# EAGLE schematic line follower INCOMPLETE (EAGLE 9.6.2)
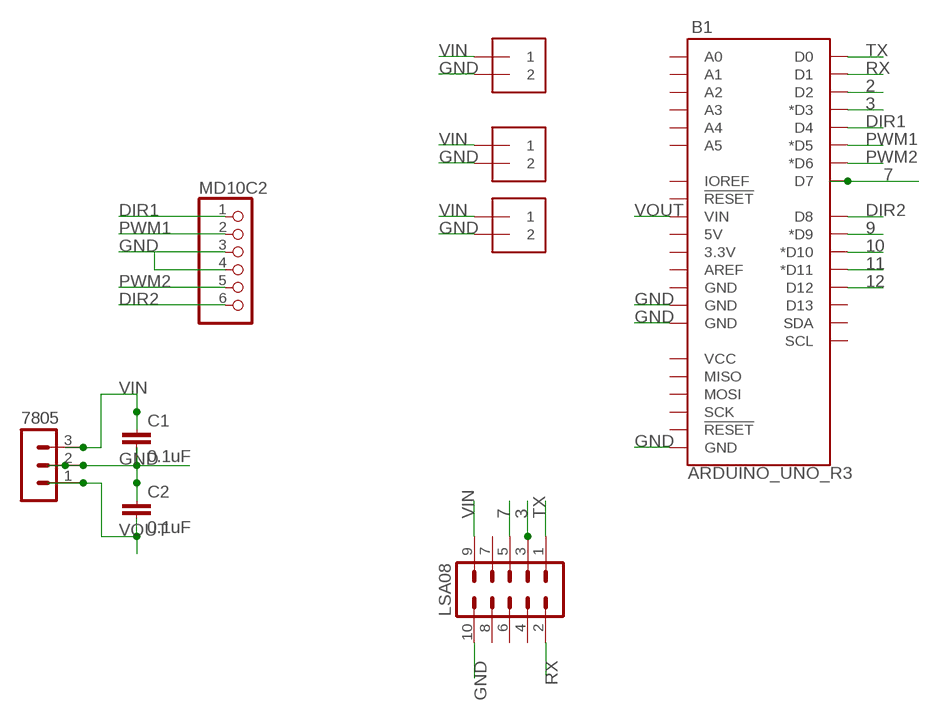
[diagram p0: schematic, sheet 1]

## Parts
7805  MA03-1  [MA03-1]
B1  ARDUINO_UNO_R3  [ARDUINO_R3]
C1  0.1uF  0.1UF-KIT-EZ-50V-20%  [CAP-PTH-SMALL-KIT]
C2  0.1uF  0.1UF-KIT-EZ-50V-20%  [CAP-PTH-SMALL-KIT]
LSA08  MA05-2  [MA05-2]
MD1POWER  1X2-3.5MM  [1X2-3.5MM]
MD2POWER  1X2-3.5MM  [1X2-3.5MM]
MD10C2  PINHD-1X6  [1X06]
POWERARDUINO  1X2-3.5MM  [1X2-3.5MM]

## Nets
2: B1.D2
3: B1.D3(*D3) LSA08.3
7: B1.D7 LSA08.5
9: B1.D9(*D9)
10: B1.D10(*D10)
11: B1.D11(*D11)
12: B1.D12
DIR1: B1.D4 MD10C2.1
DIR2: B1.D8 MD10C2.6
GND: 7805.2 B1.GND@1(GND) B1.GND@2(GND) B1.GND@3(GND) C1.2 C2.1 LSA08.10 MD1POWER.2 MD2POWER.2 MD10C2.3 MD10C2.4 POWERARDUINO.2
PWM1: B1.D5(*D5) MD10C2.2
PWM2: B1.D6(*D6) MD10C2.5
RX: B1.D1 LSA08.2
TX: B1.D0 LSA08.1
VIN: 7805.3 C1.1 LSA08.9 MD1POWER.1 MD2POWER.1 POWERARDUINO.1
VOUT: 7805.1 B1.VIN C2.2
Unconnected: B1.3.3V B1.5V B1.A0 B1.A1 B1.A2 B1.A3 B1.A4 B1.A5 B1.AREF B1.D13 B1.GND@4(GND) B1.IOREF B1.MISO B1.MOSI B1.RESET@1(!RESET!) B1.RESET@2(!RESET!) B1.SCK B1.SCL B1.SDA B1.VCC LSA08.4 LSA08.6 LSA08.7 LSA08.8

## Library data of the parts
7805 = con-lstb:MA03-1: PIN HEADER; OC_FARNELL: unknown; OC_NEWARK: unknown
B1 = SparkFun-Boards:ARDUINO_UNO_R3: Arduino R3 Footprint with SPI header Arduino Uno R3 Compatible Footprint. Matches PCB size of the original board. SparkFun Products: SAMD21 Dev Breakout <https://www.sparkfun.com/products/13672> RedBoard <https://www.sparkfun.com/products/12757> R3 Stackable Headers <https://www.sparkfun.com/products/11417>
C1 C2 = SparkFun-Capacitors:0.1UF: 0.1µF ceramic capacitors A capacitor is a passive two-terminal electrical component used to store electrical energy temporarily in an electric field.; PROD_ID: CAP-08370
LSA08 = con-lstb:MA05-2: PIN HEADER; OC_FARNELL: unknown; OC_NEWARK: unknown
MD1POWER MD2POWER POWERARDUINO = adafruit:1X2: 3.5mm Terminal block http://www.ladyada.net/library/pcb/eaglelibrary.html
MD10C2 = pinhead:PINHD-1X6: PIN HEADER